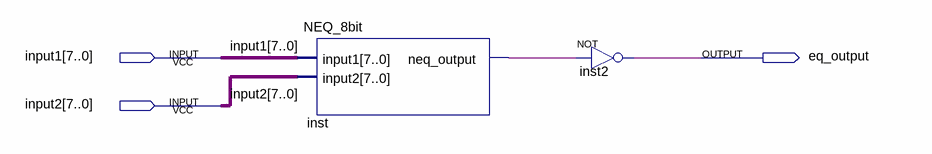
[diagram p0: schematic sheet]
// Quartus schematic EQ_8bit.bdf as structural Verilog: 2 symbols, 3 pins
module EQ_8bit (
  input  [7:0] input1,
  input  [7:0] input2,
  output eq_output
);

  wire inst_neq_output;

  NEQ_8bit inst (.input1(input1), .input2(input2), .neq_output(inst_neq_output));
  not inst2 (eq_output, inst_neq_output);
endmodule
